# Altium schematic sheet MCU Sound Card.SchDoc
size A2; Date: 1/17/2025; DrawnBy: C.Elysia
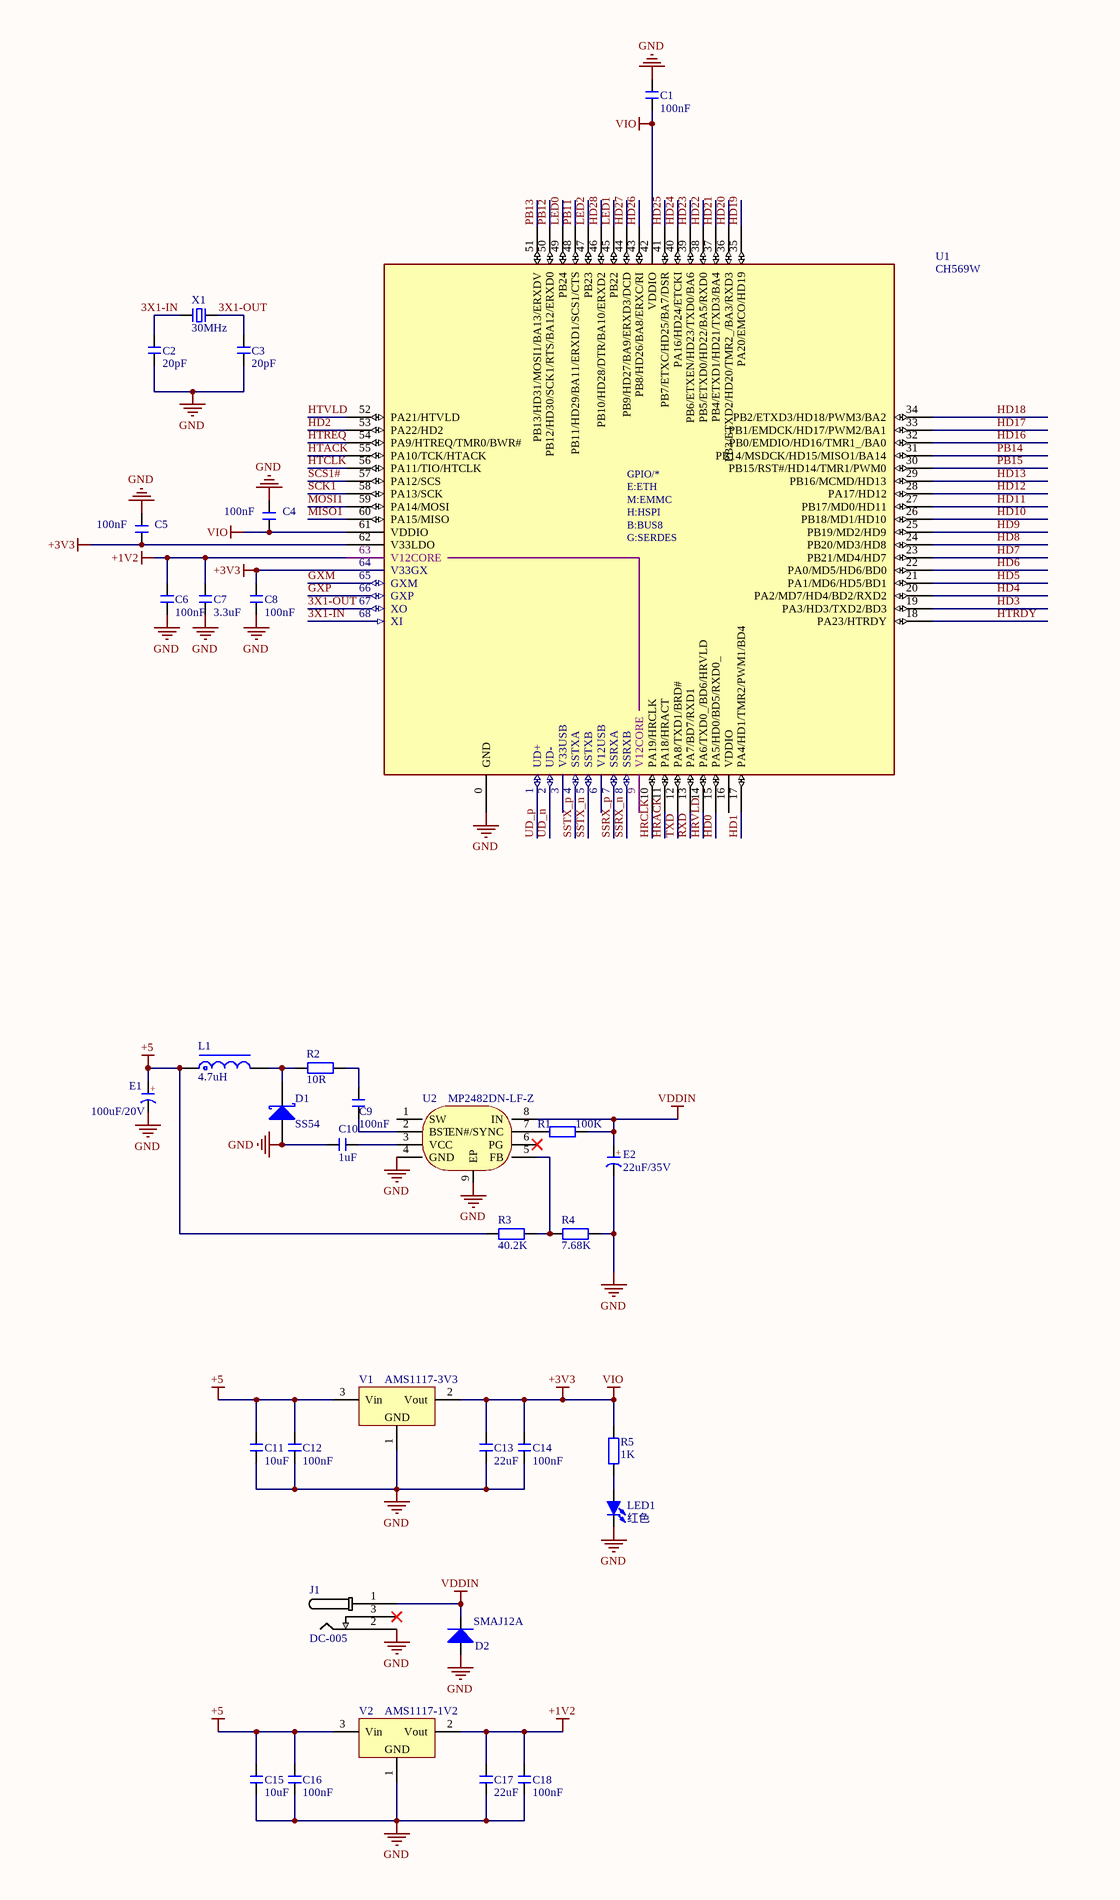
[diagram p0: MCU Sound Card.SchDoc, left]
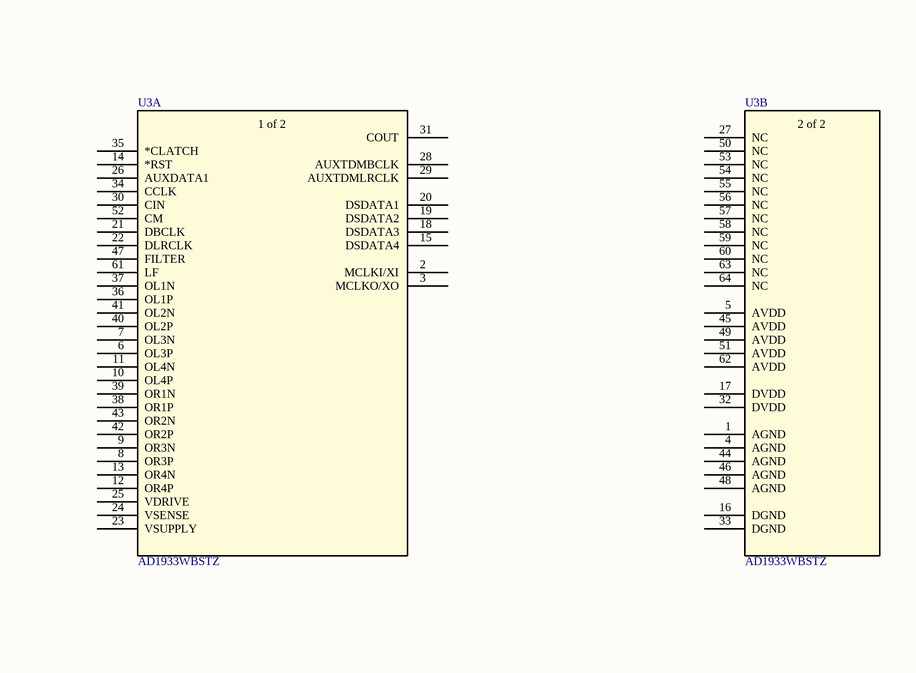
[diagram p1: MCU Sound Card.SchDoc, right]

## Parts
C1  100nF  [C 0603_L]
C2  20pF  [C 0603_L]
C3  20pF  [C 0603_L]
C4  100nF  [C 0603_L]
C5  100nF  [C 0603_L]
C6  100nF  [C 0603_L]
C7  3.3uF  [C 0603_L]
C8  100nF  [C 0603_L]
C9  100nF  [C 0603_L]
C10  1uF  [C 0603_L]
C11  10uF  [C 0603_L]
C12  100nF  [C 0603_L]
C13  22uF  [C 0603_L]
C14  100nF  [C 0603_L]
C15  10uF  [C 0603_L]
C16  100nF  [C 0603_L]
C17  22uF  [C 0603_L]
C18  100nF  [C 0603_L]
D1  SS54  [DIODE-SMA]
D2  SMAJ12A  [DIODE-SMA]
E1  100uF/20V  [CD D(7343)]
E2  22uF/35V  [CM D(6.3*5.4)]
J1  DC-005  [DC-005]
L1  4.7uH  [NR8040]
LED1  红色  [LED 0603R]
R1  100K  [R 0603_L]
R2  10R  [R 0603_L]
R3  40.2K  [R 0603_L]
R4  7.68K  [R 0603_L]
R5  1K  [R 0603_L]
U1  CH569W  [QFN68_8X8_Holes]
U2  MP2482DN-LF-Z  [SOIC-8_L5.0-W4.0-P1.27-LS6.0-BL-EP2.0]
U3  AD1933WBSTZ  [LQFP64-10*10]  (parts A,B of 2)
V1  AMS1117-3V3  [SOT223_N]
V2  AMS1117-1V2  [SOT223_N]
X1  30MHz  [OSC HC-49SMD]

## Nets
+1V2: C6.2 C7.2 C17.2 C18.2 U1.63(V12CORE) V2.2(Vout)
+3V3: C1.1 C4.1 C5.1 C8.1 C13.2 C14.2 R5.2 U1.42(VDDIO) U1.61(VDDIO) U1.62(V33LDO) U1.64(V33GX) V1.2(Vout)  [also labelled VIO]
+5: C11.2 C12.2 C15.2 C16.2 E1.1(A) L1.1 R3.2 V1.3(Vin) V2.3(Vin)
GND: C1.2 C2.1 C3.1 C4.2 C5.2 C6.1 C7.1 C8.2 C10.1 C11.1 C12.1 C13.1 C14.1 C15.1 C16.1 C17.1 C18.1 D1.1(A) D2.1(A) E1.2(K) E2.2(K) J1.2 LED1.2(K) R4.1 U1.0(GND) U2.4(GND) U2.9(EP) V1.1(GND) V2.1(GND)
VDDIN: D2.2(K) E2.1(A) J1.1 R1.2 U2.8(IN)
3X1-IN: C2.2 U1.68(XI) X1.1
3X1-OUT: C3.2 U1.67(XO) X1.2
GXM: U1.65(GXM)
GXP: U1.66(GXP)
HD0: U1.15(PA5/HD0/BD5/RXD0_)
HD1: U1.17(PA4/HD1/TMR2/PWM1/BD4)
HD2: U1.53(PA22/HD2)
HD3: U1.19(PA3/HD3/TXD2/BD3)
HD4: U1.20(PA2/MD7/HD4/BD2/RXD2)
HD5: U1.21(PA1/MD6/HD5/BD1)
HD6: U1.22(PA0/MD5/HD6/BD0)
HD7: U1.23(PB21/MD4/HD7)
HD8: U1.24(PB20/MD3/HD8)
HD9: U1.25(PB19/MD2/HD9)
HD10: U1.26(PB18/MD1/HD10)
HD11: U1.27(PB17/MD0/HD11)
HD12: U1.28(PA17/HD12)
HD13: U1.29(PB16/MCMD/HD13)
HD16: U1.32(PB0/EMDIO/HD16/TMR1_/BA0)
HD17: U1.33(PB1/EMDCK/HD17/PWM2/BA1)
HD18: U1.34(PB2/ETXD3/HD18/PWM3/BA2)
HD19: U1.35(PA20/EMCO/HD19)
HD20: U1.36(PB3/ETXD2/HD20/TMR2_/BA3/RXD3)
HD21: U1.37(PB4/ETXD1/HD21/TXD3/BA4)
HD22: U1.38(PB5/ETXD0/HD22/BA5/RXD0)
HD23: U1.39(PB6/ETXEN/HD23/TXD0/BA6)
HD24: U1.40(PA16/HD24/ETCKI)
HD25: U1.41(PB7/ETXC/HD25/BA7/DSR)
HD26: U1.43(PB8/HD26/BA8/ERXC/RI)
HD27: U1.44(PB9/HD27/BA9/ERXD3/DCD)
HD28: U1.46(PB10/HD28/DTR/BA10/ERXD2)
HRACK: U1.11(PA18/HRACT)
HRCLK: U1.10(PA19/HRCLK)
HRVLD: U1.14(PA6/TXD0_/BD6/HRVLD)
HTACK: U1.55(PA10/TCK/HTACK)
HTCLK: U1.56(PA11/TIO/HTCLK)
HTRDY: U1.18(PA23/HTRDY)
HTREQ: U1.54(PA9/HTREQ/TMR0/BWR#)
HTVLD: U1.52(PA21/HTVLD)
LED0: U1.49(PB24)
LED1: U1.45(PB22)
LED2: U1.47(PB23)
MISO1: U1.60(PA15/MISO)
MOSI1: U1.59(PA14/MOSI)
PB11: U1.48(PB11/HD29/BA11/ERXD1/SCS1/CTS)
PB12: U1.50(PB12/HD30/SCK1/RTS/BA12/ERXD0)
PB13: U1.51(PB13/HD31/MOSI1/BA13/ERXDV)
PB14: U1.31(PB14/MSDCK/HD15/MISO1/BA14)
PB15: U1.30(PB15/RST#/HD14/TMR1/PWM0)
RXD: U1.13(PA7/BD7/RXD1)
SCK1: U1.58(PA13/SCK)
SCS1#: U1.57(PA12/SCS)
SSRX_n: U1.8(SSRXB)
SSRX_p: U1.7(SSRXA)
SSTX_n: U1.5(SSTXB)
SSTX_p: U1.4(SSTXA)
TXD: U1.12(PA8/TXD1/BRD#)
UD_n: U1.2(UD-)
UD_p: U1.1(UD+)
NetC9_1: C9.1 U2.2(BST)
NetC9_2: C9.2 R2.2
NetC10_2: C10.2 U2.3(VCC)
NetD1_2: D1.2(K) L1.2 R2.1
NetLED1_1: LED1.1(A) R5.1
NetR1_1: R1.1 U2.7(EN#/SYNC)
NetR3_1: R3.1 R4.2 U2.5(FB)

Not connected (* = marked no-connect by the designer): J1 3*; U1 3(V33USB) 6(V12USB) 9(V12CORE) 16(VDDIO); U2 1(SW) 6(PG)*; U3 1(AGND) 2(MCLKI/XI) 3(MCLKO/XO) 4(AGND) 5(AVDD) 6(OL3P) 7(OL3N) 8(OR3P) 9(OR3N) 10(OL4P) 11(OL4N) 12(OR4P) 13(OR4N) 14(*RST) 15(DSDATA4) 16(DGND) 17(DVDD) 18(DSDATA3) 19(DSDATA2) 20(DSDATA1) 21(DBCLK) 22(DLRCLK) 23(VSUPPLY) 24(VSENSE) 25(VDRIVE) 26(AUXDATA1) 27(NC) 28(AUXTDMBCLK) 29(AUXTDMLRCLK) 30(CIN) 31(COUT) 32(DVDD) 33(DGND) 34(CCLK) 35(*CLATCH) 36(OL1P) 37(OL1N) 38(OR1P) 39(OR1N) 40(OL2P) 41(OL2N) 42(OR2P) 43(OR2N) 44(AGND) 45(AVDD) 46(AGND) 47(FILTER) 48(AGND) 49(AVDD) 50(NC) 51(AVDD) 52(CM) 53(NC) 54(NC) 55(NC) 56(NC) 57(NC) 58(NC) 59(NC) 60(NC) 61(LF) 62(AVDD) 63(NC) 64(NC)

## Notes on the sheet
- (in symbol AD1933WBSTZ, part A) 1 of 2
- (in symbol AD1933WBSTZ, part B) 2 of 2
- (in symbol CE_SMD) +
- (in symbol CH569W) GPIO/*; E:ETH; M:EMMC; H:HSPI; B:BUS8; G:SERDES
- (in symbol CT) +

## Library data of the parts
C1-C18 = C: 贴片电容; BOM名称: 无极性贴片电容; 淘宝ID: 封装库来自淘宝 ID：黄晶宝石; 联系售后，技术支持: https://shop463601444.taobao.com; 唯一出售店铺网址: https://shop463601444.taobao.com
D1 = D-Schottky: 肖特基二极管; Published: 8-Jun-2000; LatestRevisionDate: 17-Jul-2002; LatestRevisionNote: Re-released for DXP Platform.; PackageReference: SMB; Publisher: Altium Limited; Code_JEDEC: DO-214-AA
D2 = TVS: TVS保护; Type: E6.8CA; Published: 8-Jun-2000; LatestRevisionDate: 17-Jul-2002; LatestRevisionNote: Re-released for DXP Platform.; PackageDocument: Sep-1996; PackageReference: SMC; Publisher: Altium Limited; Code_JEDEC: DO-214-AB
E1 = CT: 贴片钽电容; 淘宝ID: 封装库来自淘宝 ID：黄晶宝石; BOM名称: 贴片钽电容; 联系售后: https://shop463601444.taobao.com
E2 = CE_SMD: 贴片电解电容; 版权归属: 封装库来自淘宝 ID：黄晶宝石; BOM名称: 贴片电解电容; 联系售后: https://shop463601444.taobao.com
J1 = DC-005: 带屏蔽DC电源接口; Mfr_Name: XKB Connectivity; Type: Power Connectors; RefDes: RefDes
L1 = L-NR: NR磁胶电感; 版权归属: 来自淘宝 ID：黄晶宝石; BOM名称: NR磁胶电感; 联系售后: https://shop463601444.taobao.com
LED1 = LED-SMD: 贴片LED; 版权归属: 封装库来自淘宝 ID：黄晶宝石; BOM名称: 贴片LED; 学习资源: https://shop463601444.taobao.com
R1-R5 = R: 贴片电阻; 版权归属: 来自淘宝 ID：黄晶宝石; 封装库来自淘宝卖家 ID：黄晶宝石: 其他店铺购入均为盗版，不享受售后技术支持服务，请立即申请退款; BOM名称: 贴片电阻; 联系售后: https://shop463601444.taobao.com
U1 = CH569W: 32bit RISC-V MCU with USB 3.0 SS/HS & 4*UART & ETH & HSPI
U2 = MP2482DN-LF-Z: DC降压芯片; Manufacturer: MPS; Add into BOM: yes; Symbol: MP2482DN-LF-Z; Device: MP2482DN-LF-Z; LCSC Part Name: MP2482DN-LF-Z; Supplier Part: C56736; Manufacturer Part: MP2482DN-LF-Z; Supplier Footprint: SOIC-8-EP; JLCPCB Part Class: Extended Part; Supplier: LCSC; Convert to PCB: yes
U3 = AD1933WBSTZ: 8 DAC、192 kHz、24位编解码器，内置PLL; Mfr_Name: Analog Devices Inc; RefDes: RefDes; Type: Type
V1 V2 = AMS1117: 三端稳压芯片; BOM名称: 稳压芯片; 淘宝ID: 封装库来自淘宝 ID：黄晶宝石; 欢迎光临淘宝店铺: https://shop463601444.taobao.com
X1 = XTAL-2P: 2脚无源脚晶振; 版权归属: 封装库来自淘宝卖家 ID：黄晶宝石; BOM名称: 2脚无源脚晶振; 学习资源: https://shop463601444.taobao.com